# EAGLE design VoltimetroDigital (EAGLE 6.2)
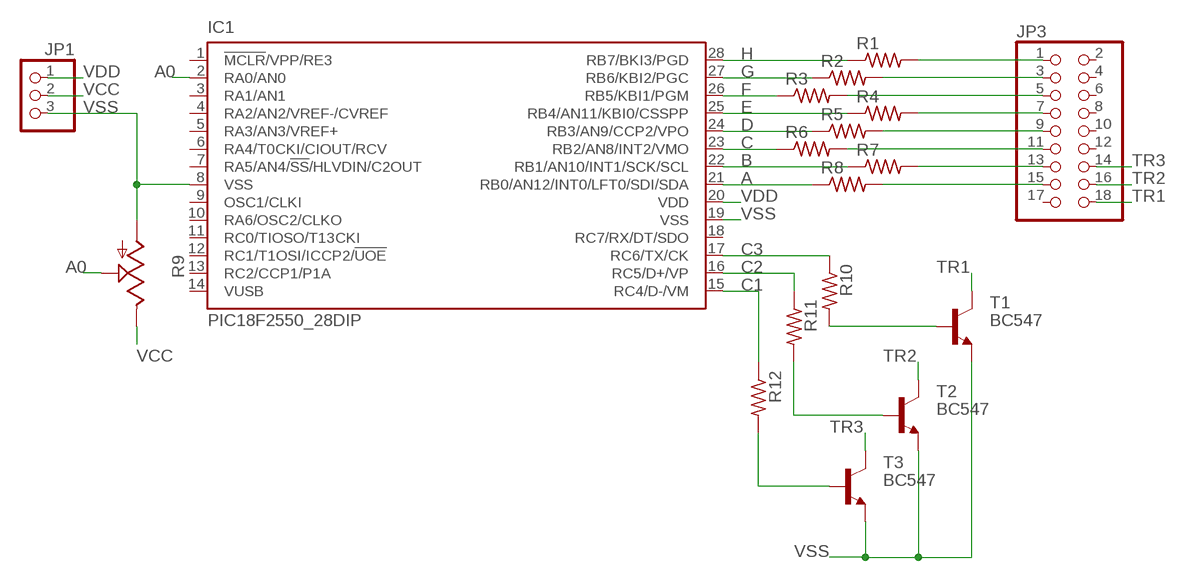
[diagram p0: schematic, sheet 1]

## Parts
IC1  PIC18F2550_28DIP  [DIL28-3]
JP1  PINHD-1X3  [1X03]
JP3  PINHD-2X9  [2X09]
R1  R-US_0204/7  [0204/7]
R2  R-US_0204/7  [0204/7]
R3  R-US_0204/7  [0204/7]
R4  R-US_0204/7  [0204/7]
R5  R-US_0204/7  [0204/7]
R6  R-US_0204/7  [0204/7]
R7  R-US_0204/7  [0204/7]
R8  R-US_0204/7  [0204/7]
R9  TRIM_US-LI10  [LI10]
R10  R-US_0204/7  [0204/7]
R11  R-US_0204/7  [0204/7]
R12  R-US_0204/7  [0204/7]
T1  BC547  [TO92]
T2  BC547  [TO92]
T3  BC547  [TO92]

## Nets
A: IC1.21(RB0/AN12/INT0/LFT0/SDI/SDA) R8.1
A0: IC1.2(RA0/AN0) R9.S
B: IC1.22(RB1/AN10/INT1/SCK/SCL) R7.1
C: IC1.23(RB2/AN8/INT2/VMO) R6.1
C1: IC1.15(RC4/D-/VM) R12.1
C2: IC1.16(RC5/D+/VP) R11.1
C3: IC1.17(RC6/TX/CK) R10.1
D: IC1.24(RB3/AN9/CCP2/VPO) R5.1
E: IC1.25(RB4/AN11/KBI0/CSSPP) R4.1
F: IC1.26(RB5/KBI1/PGM) R3.1
G: IC1.27(RB6/KBI2/PGC) R2.1
H: IC1.28(RB7/BKI3/PGD) R1.1
N$1: JP3.1 R1.2
N$2: JP3.3 R2.2
N$3: JP3.5 R3.2
N$4: JP3.7 R4.2
N$5: JP3.9 R5.2
N$6: JP3.11 R6.2
N$7: JP3.13 R7.2
N$8: JP3.15 R8.2
N$11: R12.2 T3.2(B)
N$12: R11.2 T2.2(B)
N$13: R10.2 T1.2(B)
TR1: JP3.18 T1.3(C)
TR2: JP3.16 T2.3(C)
TR3: JP3.14 T3.3(C)
VCC: JP1.2 R9.E
VDD: IC1.20(VDD) JP1.1
VSS: IC1.8(VSS) IC1.19(VSS) JP1.3 R9.A T1.1(E) T2.1(E) T3.1(E)
Unconnected: IC1.1(!MCLR!/VPP/RE3) IC1.3(RA1/AN1) IC1.4(RA2/AN2/VREF-/CVREF) IC1.5(RA3/AN3/VREF+) IC1.6(RA4/T0CKI/CIOUT/RCV) IC1.7(RA5/AN4/!SS!/HLVDIN/C2OUT) IC1.9(OSC1/CLKI) IC1.10(RA6/OSC2/CLKO) IC1.11(RC0/TIOSO/T13CKI) IC1.12(RC1/T1OSI/ICCP2/!UOE) IC1.13(RC2/CCP1/P1A) IC1.14(VUSB) IC1.18(RC7/RX/DT/SDO) JP3.2 JP3.4 JP3.6 JP3.8 JP3.10 JP3.12 JP3.17

## Library data of the parts
IC1 = microchip:PIC18F2*_28: USB Microcontrollers with nanoWatt Technology High-Performance, Enhanced Flash, 28/40/44-Pin, Source: http://ww1.microchip.com/downloads/en/devicedoc/39632c.pdf; MF: MICROCHIP; MPN: PIC18F2550-I/SP; OC_FARNELL: 1523822; OC_NEWARK: 80K6054
JP1 = pinhead:PINHD-1X3: PIN HEADER
JP3 = pinhead:PINHD-2X9: PIN HEADER
R1-R8 R10-R12 = resistor:R-US_: RESISTOR, American symbol
R9 = pot:TRIM_US-: POTENTIOMETER
T1-T3 = transistor-neu-to92:BC547: NPN TRANSISTOR

## Board
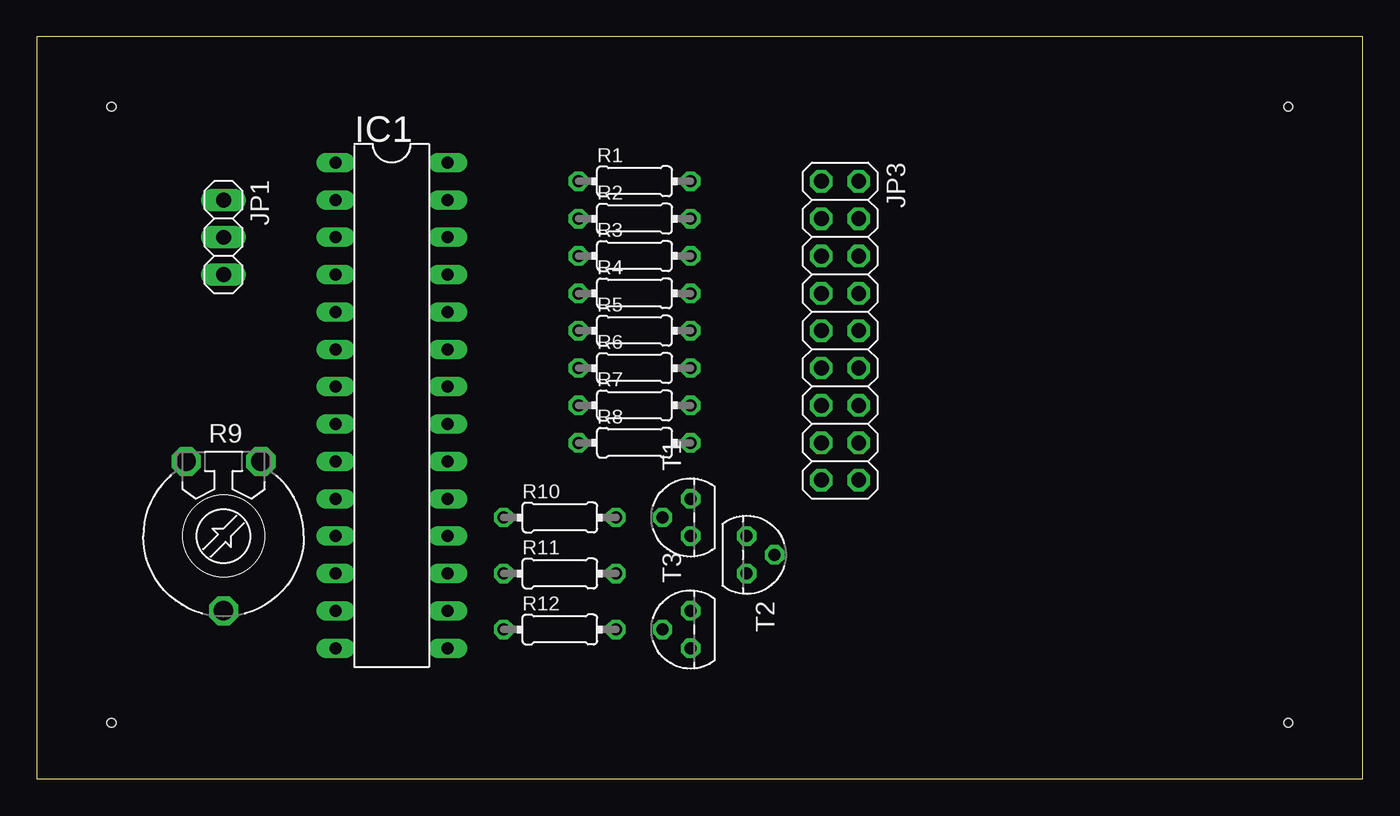
[diagram p1: board, top side]
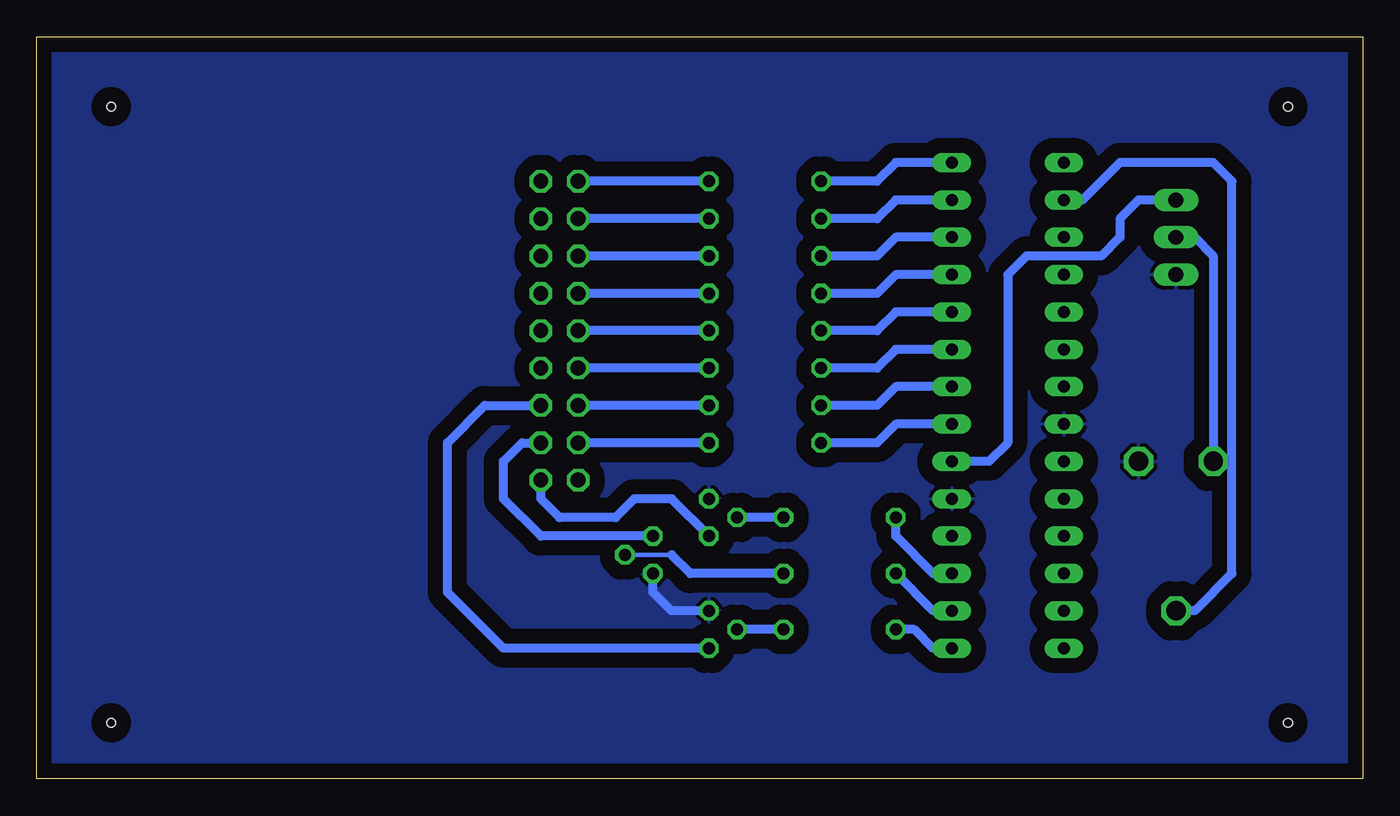
[diagram p2: board, bottom side, seen from below]

Size 90.15 x 50.47 mm. Coordinates in mm from the lower left corner, seen from the top.
Outline: 0,0 90.15,0 90.15,50.47 0,50.47 0,0
Copper layers (1*16): Top 0.035mm / dielectric 1.5mm / Bottom 0.035mm
Design rules: minimum track width 10mil, minimum drill 24mil, track to track 8mil, track to pad 8mil, pad to pad 8mil, via to via 8mil, smd to smd 8mil, copper to edge 40mil, drill to drill 8mil, minimum pad ring 10mil, minimum via ring 8mil, stop-mask expansion 4mil, vias tented up to drill 0mil, thermal gap 10mil
Holes 0.6 mm at 5.08,3.81 5.08,45.72 85.09,3.81 85.09,45.72

### Footprints (pad centres in the part's own frame; a part is rotated, then mirrored left to right if it is on the bottom)
DIL28-3 = drill 0.813 long: 1 -16.51,-3.81; 2 -13.97,-3.81; 3 -11.43,-3.81; 4 -8.89,-3.81; 5 -6.35,-3.81; 6 -3.81,-3.81; 7 -1.27,-3.81; 8 1.27,-3.81; 9 3.81,-3.81; 10 6.35,-3.81; 11 8.89,-3.81; 12 11.43,-3.81; 13 13.97,-3.81; 14 16.51,-3.81; 15 16.51,3.81; 16 13.97,3.81; 17 11.43,3.81; 18 8.89,3.81; 19 6.35,3.81; 20 3.81,3.81; 21 1.27,3.81; 22 -1.27,3.81; 23 -3.81,3.81; 24 -6.35,3.81; 25 -8.89,3.81; 26 -11.43,3.81; 27 -13.97,3.81; 28 -16.51,3.81
1X03 = drill 1.016 long: 1 -2.54,0; 2 0,0; 3 2.54,0
2X09 = drill 1.016 octagon: 1 -10.16,-1.27; 2 -10.16,1.27; 3 -7.62,-1.27; 4 -7.62,1.27; 5 -5.08,-1.27; 6 -5.08,1.27; 7 -2.54,-1.27; 8 -2.54,1.27; 9 0,-1.27; 10 0,1.27; 11 2.54,-1.27; 12 2.54,1.27; 13 5.08,-1.27; 14 5.08,1.27; 15 7.62,-1.27; 16 7.62,1.27; 17 10.16,-1.27; 18 10.16,1.27
0204/7 = drill 0.813 octagon: 1 -3.81,0; 2 3.81,0
LI10 = drill 1.321 octagon: A -2.54,-5.08; E 2.54,-5.08; S 0,5.08
TO92 = drill 0.813 octagon: 1 1.27,0; 2 0,1.905; 3 -1.27,0

### Placement (x,y rotation side)
IC1  24.13,25.4 270 top
JP1  12.7,36.83 270 top
JP3  54.61,30.48 270 top
R1  40.64,40.64 0 top
R2  40.64,38.1 0 top
R3  40.64,35.56 0 top
R4  40.64,33.02 0 top
R5  40.64,30.48 0 top
R6  40.64,27.94 0 top
R7  40.64,25.4 0 top
R8  40.64,22.86 0 top
R9  12.7,16.51 180 top
R10  35.56,17.78 0 top
R11  35.56,13.97 0 top
R12  35.56,10.16 0 top
T1  44.45,17.78 90 top
T2  48.26,15.24 270 top
T3  44.45,10.16 90 top

### Tracks (layer width: path | path; a pad name or v marks a point on that pad's centre or on a via)
A
  Bottom 0.61: IC1.21 31.75,24.13 33.02,22.86 R8.1
A0
  Bottom 0.61: IC1.2 19.05,39.37 16.51,41.91 10.16,41.91 8.89,40.64 8.89,13.97 11.43,11.43 R9.S
B
  Bottom 0.61: IC1.22 31.75,26.67 33.02,25.4 R7.1
C
  Bottom 0.61: IC1.23 31.75,29.21 33.02,27.94 R6.1
C1
  Bottom 0.61: IC1.15 29.21,8.89 30.48,10.16 R12.1
C2
  Bottom 0.61: IC1.16 29.21,11.43 R11.1
C3
  Bottom 0.61: IC1.17 29.21,13.97 31.75,16.51 R10.1
D
  Bottom 0.61: IC1.24 31.75,31.75 33.02,30.48 R5.1
E
  Bottom 0.61: IC1.25 31.75,34.29 33.02,33.02 R4.1
F
  Bottom 0.61: IC1.26 31.75,36.83 33.02,35.56 R3.1
G
  Bottom 0.61: IC1.27 31.75,39.37 33.02,38.1 R2.1
H
  Bottom 0.61: IC1.28 31.75,41.91 33.02,40.64 R1.1
N$1
  Bottom 0.61: R1.2 JP3.1
N$2
  Bottom 0.61: R2.2 JP3.3
N$3
  Bottom 0.61: R3.2 JP3.5
N$4
  Bottom 0.61: R4.2 JP3.7
N$5
  Bottom 0.61: R5.2 JP3.9
N$6
  Bottom 0.61: R6.2 JP3.11
N$7
  Bottom 0.61: R7.2 JP3.13
N$8
  Bottom 0.61: R8.2 JP3.15
N$11
  Bottom 0.61: R12.2 T3.2
N$12
  Bottom 0.305: 46.99,15.24 T2.2
  Bottom 0.61: R11.2 45.72,13.97 46.99,15.24
N$13
  Bottom 0.61: R10.2 T1.2
TR1
  Bottom 0.61: T1.3 46.99,19.05 49.53,19.05 50.8,17.78 54.61,17.78 55.88,19.05 JP3.18
TR2
  Bottom 0.61: T2.3 55.88,16.51 58.42,19.05 58.42,21.59 57.15,22.86 JP3.16
TR3
  Bottom 0.61: T3.3 58.42,8.89 62.23,12.7 62.23,22.86 59.69,25.4 JP3.14
VCC
  Bottom 0.61: JP1.2 11.43,36.83 10.16,35.56 R9.E
VDD
  Bottom 0.61: JP1.1 15.24,39.37 16.51,38.1 16.51,36.83 17.78,35.56 22.86,35.56 24.13,34.29 24.13,22.86 25.4,21.59 IC1.20
VSS
  Bottom 0.61: T3.1 46.99,11.43 48.26,12.7 T2.1
  pour Bottom (isolate 1.016): 0,50.8 90.17,50.8 90.17,0 0,0

### Text on the board
Labels: B7 | 180 | H | VDD | A0 | B6 | 180 | G | VCC | B5 | 180 | F | GND | B4 | 180 | E | B3 | 180 | D | B2 | 180 | C | B1 | 180 | B | C3 | B0 | ADJUST | 180 | A | C2 | 18F886 | C1 | 1 K | 1 K | 1 K